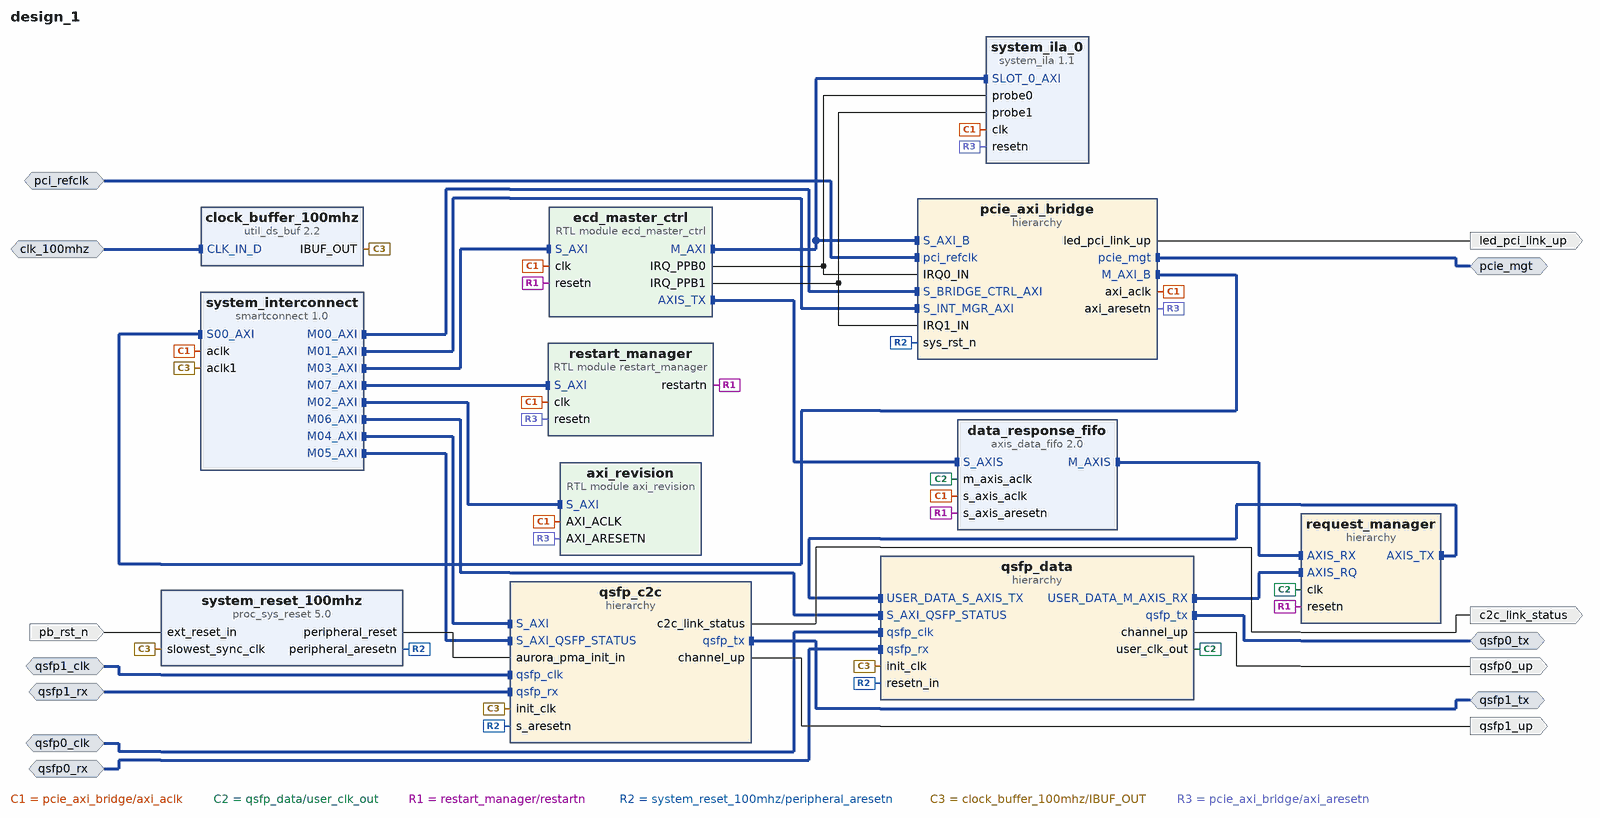
[diagram p0: block diagram of the top level]
# Vivado block design design_1, xczu19eg-ffvc1760-2-i, Vivado 2021.1
create_bd_design design_1

create_bd_intf_port -mode Slave -vlnv xilinx.com:interface:diff_clock_rtl:1.0 clk_100mhz
create_bd_intf_port -mode Slave -vlnv xilinx.com:interface:diff_clock_rtl:1.0 pci_refclk
create_bd_intf_port -mode Master -vlnv xilinx.com:interface:pcie_7x_mgt_rtl:1.0 pcie_mgt
create_bd_intf_port -mode Slave -vlnv xilinx.com:interface:diff_clock_rtl:1.0 qsfp0_clk
set_property -dict {CONFIG.FREQ_HZ 322265625} [get_bd_intf_ports qsfp0_clk]
create_bd_intf_port -mode Master -vlnv xilinx.com:display_aurora:GT_Serial_Transceiver_Pins_TX_rtl:1.0 qsfp0_tx
create_bd_intf_port -mode Slave -vlnv xilinx.com:display_aurora:GT_Serial_Transceiver_Pins_RX_rtl:1.0 qsfp0_rx
create_bd_intf_port -mode Master -vlnv xilinx.com:display_aurora:GT_Serial_Transceiver_Pins_TX_rtl:1.0 qsfp1_tx
create_bd_intf_port -mode Slave -vlnv xilinx.com:display_aurora:GT_Serial_Transceiver_Pins_RX_rtl:1.0 qsfp1_rx
create_bd_intf_port -mode Slave -vlnv xilinx.com:interface:diff_clock_rtl:1.0 qsfp1_clk
set_property -dict {CONFIG.FREQ_HZ 322265625} [get_bd_intf_ports qsfp1_clk]
create_bd_port -dir I -type rst pb_rst_n
create_bd_port -dir O led_pci_link_up
create_bd_port -dir O qsfp0_up
create_bd_port -dir O qsfp1_up
create_bd_port -dir O c2c_link_status

create_bd_cell -type ip -vlnv xilinx.com:ip:proc_sys_reset:5.0 system_reset_100mhz
create_bd_cell -type ip -vlnv xilinx.com:ip:util_ds_buf:2.2 clock_buffer_100mhz
create_bd_cell -type hier pcie_axi_bridge
create_bd_cell -type hier qsfp_data
create_bd_cell -type ip -vlnv xilinx.com:ip:axis_data_fifo:2.0 data_response_fifo
set_property -dict {CONFIG.FIFO_DEPTH 4096 CONFIG.IS_ACLK_ASYNC 1} [get_bd_cells data_response_fifo]
create_bd_cell -type hier qsfp_c2c
create_bd_cell -type module -reference restart_manager restart_manager
create_bd_cell -type hier request_manager
create_bd_cell -type ip -vlnv xilinx.com:ip:system_ila:1.1 system_ila_0
set_property -dict [list \
  CONFIG.C_DATA_DEPTH 4096 \
  CONFIG.C_MON_TYPE MIX \
  CONFIG.C_NUM_MONITOR_SLOTS 1 \
  CONFIG.C_NUM_OF_PROBES 2 \
  CONFIG.C_PROBE0_TYPE 0 \
  CONFIG.C_PROBE1_TYPE 0 \
  CONFIG.C_SLOT_0_APC_EN 0 \
  CONFIG.C_SLOT_0_AXI_AR_SEL_DATA 1 \
  CONFIG.C_SLOT_0_AXI_AR_SEL_TRIG 1 \
  CONFIG.C_SLOT_0_AXI_AW_SEL_DATA 1 \
  CONFIG.C_SLOT_0_AXI_AW_SEL_TRIG 1 \
  CONFIG.C_SLOT_0_AXI_B_SEL_DATA 1 \
  CONFIG.C_SLOT_0_AXI_B_SEL_TRIG 1 \
  CONFIG.C_SLOT_0_AXI_R_SEL_DATA 1 \
  CONFIG.C_SLOT_0_AXI_R_SEL_TRIG 1 \
  CONFIG.C_SLOT_0_AXI_W_SEL_DATA 1 \
  CONFIG.C_SLOT_0_AXI_W_SEL_TRIG 1 \
  CONFIG.C_SLOT_0_INTF_TYPE xilinx.com:interface:aximm_rtl:1.0 \
] [get_bd_cells system_ila_0]
create_bd_cell -type module -reference ecd_master_ctrl ecd_master_ctrl
create_bd_cell -type ip -vlnv xilinx.com:ip:smartconnect:1.0 system_interconnect
set_property -dict {CONFIG.HAS_ARESETN 0 CONFIG.NUM_CLKS 2 CONFIG.NUM_MI 8 CONFIG.NUM_SI 1} [get_bd_cells system_interconnect]
create_bd_cell -type module -reference axi_revision axi_revision

# ---- hierarchy /pcie_axi_bridge ----
current_bd_instance /pcie_axi_bridge
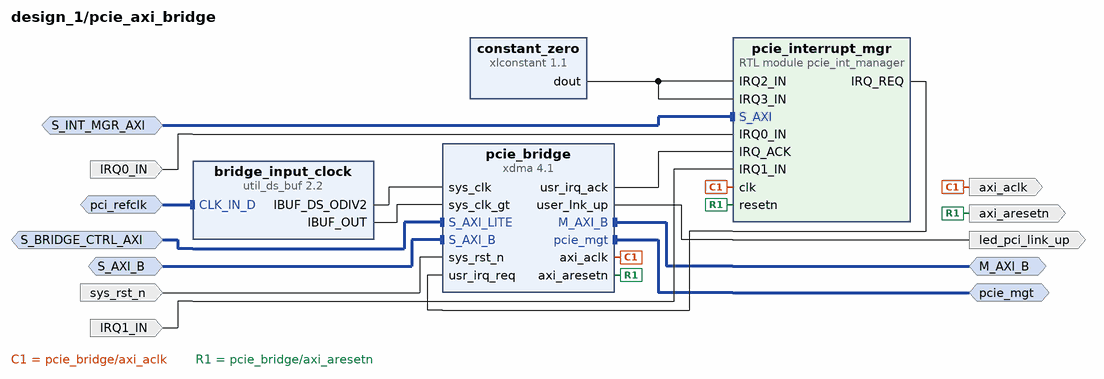
[diagram p1: block diagram inside /pcie_axi_bridge]
create_bd_intf_pin -mode Slave -vlnv xilinx.com:interface:aximm_rtl:1.0 S_BRIDGE_CTRL_AXI
create_bd_intf_pin -mode Slave -vlnv xilinx.com:interface:aximm_rtl:1.0 S_AXI_B
create_bd_intf_pin -mode Master -vlnv xilinx.com:interface:pcie_7x_mgt_rtl:1.0 pcie_mgt
create_bd_intf_pin -mode Master -vlnv xilinx.com:interface:aximm_rtl:1.0 M_AXI_B
create_bd_intf_pin -mode Slave -vlnv xilinx.com:interface:aximm_rtl:1.0 S_INT_MGR_AXI
create_bd_intf_pin -mode Slave -vlnv xilinx.com:interface:diff_clock_rtl:1.0 pci_refclk
create_bd_pin -dir O -type rst axi_aresetn
create_bd_pin -dir O -type clk axi_aclk
create_bd_pin -dir O led_pci_link_up
create_bd_pin -dir I -type rst sys_rst_n
create_bd_pin -dir I IRQ0_IN
create_bd_pin -dir I IRQ1_IN

create_bd_cell -type ip -vlnv xilinx.com:ip:xdma:4.1 pcie_bridge
set_property -dict [list \
  CONFIG.PF0_DEVICE_ID_mqdma 903F \
  CONFIG.PF0_SRIOV_VF_DEVICE_ID A03F \
  CONFIG.PF2_DEVICE_ID_mqdma 923F \
  CONFIG.PF3_DEVICE_ID_mqdma 933F \
  CONFIG.axi_addr_width 64 \
  CONFIG.axi_data_width 512_bit \
  CONFIG.axibar2pciebar_0 0x0 \
  CONFIG.axibar_num 1 \
  CONFIG.axilite_master_en true \
  CONFIG.axilite_master_size 8 \
  CONFIG.axisten_freq 250 \
  CONFIG.bridge_burst true \
  CONFIG.c_s_axi_supports_narrow_burst false \
  CONFIG.cfg_mgmt_if false \
  CONFIG.enable_jtag_dbg true \
  CONFIG.functional_mode AXI_Bridge \
  CONFIG.mode_selection Advanced \
  CONFIG.pcie_blk_locn X1Y0 \
  CONFIG.pcie_extended_tag false \
  CONFIG.pciebar2axibar_0 0x00000000 \
  CONFIG.pciebar2axibar_1 0x800000000 \
  CONFIG.pciebar2axibar_axil_master 0A0000000 \
  CONFIG.pf0_Use_Class_Code_Lookup_Assistant false \
  CONFIG.pf0_bar0_64bit false \
  CONFIG.pf0_bar0_scale Megabytes \
  CONFIG.pf0_bar0_size 1 \
  CONFIG.pf0_bar1_enabled true \
  CONFIG.pf0_bar1_scale Megabytes \
  CONFIG.pf0_bar1_size 1 \
  CONFIG.pf0_bar2_enabled false \
  CONFIG.pf0_base_class_menu Simple_communication_controllers \
  CONFIG.pf0_class_code_base 07 \
  CONFIG.pf0_class_code_interface 01 \
  CONFIG.pf0_class_code_sub 00 \
  CONFIG.pf0_device_id 903F \
  CONFIG.pf0_interrupt_pin INTA \
  CONFIG.pf0_msi_enabled false \
  CONFIG.pf0_sub_class_interface_menu 16450_compatible_serial_controller \
  CONFIG.pf0_subsystem_id 0007 \
  CONFIG.pl_link_cap_max_link_speed 8.0_GT/s \
  CONFIG.pl_link_cap_max_link_width X16 \
  CONFIG.plltype QPLL1 \
  CONFIG.xdma_num_usr_irq 1 \
  CONFIG.xdma_sts_ports false \
  CONFIG.xdma_wnum_rids 32 \
] [get_bd_cells pcie_bridge]
create_bd_cell -type ip -vlnv xilinx.com:ip:xlconstant:1.1 constant_zero
set_property -dict {CONFIG.CONST_VAL 0 CONFIG.CONST_WIDTH 1} [get_bd_cells constant_zero]
create_bd_cell -type ip -vlnv xilinx.com:ip:util_ds_buf:2.2 bridge_input_clock
set_property -dict {CONFIG.C_BUF_TYPE IBUFDSGTE} [get_bd_cells bridge_input_clock]
create_bd_cell -type module -reference pcie_int_manager pcie_interrupt_mgr

# ---- hierarchy /qsfp_data ----
current_bd_instance /qsfp_data
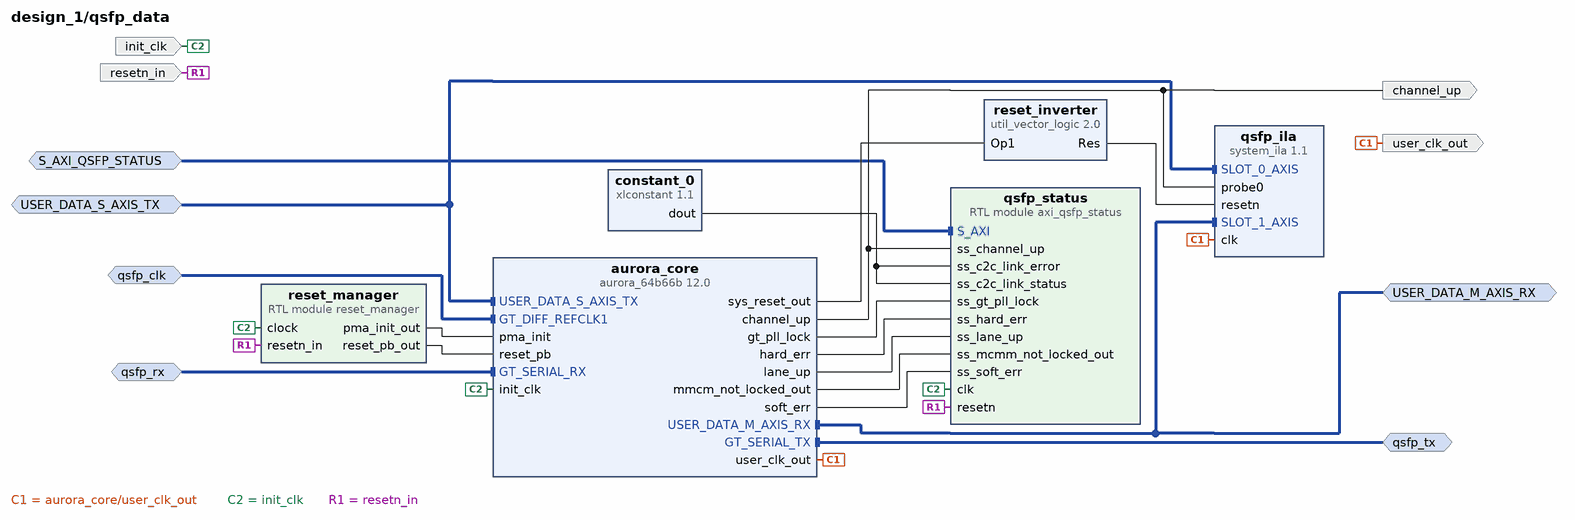
[diagram p2: block diagram inside /qsfp_data]
create_bd_intf_pin -mode Slave -vlnv xilinx.com:interface:diff_clock_rtl:1.0 qsfp_clk
create_bd_intf_pin -mode Master -vlnv xilinx.com:display_aurora:GT_Serial_Transceiver_Pins_TX_rtl:1.0 qsfp_tx
create_bd_intf_pin -mode Slave -vlnv xilinx.com:display_aurora:GT_Serial_Transceiver_Pins_RX_rtl:1.0 qsfp_rx
create_bd_intf_pin -mode Master -vlnv xilinx.com:interface:axis_rtl:1.0 USER_DATA_M_AXIS_RX
create_bd_intf_pin -mode Slave -vlnv xilinx.com:interface:axis_rtl:1.0 USER_DATA_S_AXIS_TX
create_bd_intf_pin -mode Slave -vlnv xilinx.com:interface:aximm_rtl:1.0 S_AXI_QSFP_STATUS
create_bd_pin -dir I -type clk init_clk
create_bd_pin -dir I -type rst resetn_in
create_bd_pin -dir O channel_up
create_bd_pin -dir O -type clk user_clk_out

create_bd_cell -type ip -vlnv xilinx.com:ip:aurora_64b66b:12.0 aurora_core
set_property -dict [list \
  CONFIG.CHANNEL_ENABLE {X0Y12 X0Y13 X0Y14 X0Y15} \
  CONFIG.C_AURORA_LANES 4 \
  CONFIG.C_GT_CLOCK_1 GTYQ0 \
  CONFIG.C_GT_TYPE GTY \
  CONFIG.C_LINE_RATE 25.78125 \
  CONFIG.C_REFCLK_FREQUENCY 322.265625 \
  CONFIG.C_REFCLK_SOURCE MGTREFCLK0_of_Quad_X0Y3 \
  CONFIG.C_START_LANE X0Y12 \
  CONFIG.C_START_QUAD Quad_X0Y3 \
  CONFIG.C_UCOLUMN_USED left \
  CONFIG.SupportLevel 1 \
  CONFIG.drp_mode Disabled \
  CONFIG.interface_mode Streaming \
] [get_bd_cells aurora_core]
create_bd_cell -type ip -vlnv xilinx.com:ip:util_vector_logic:2.0 reset_inverter
set_property -dict {CONFIG.C_OPERATION not CONFIG.C_SIZE 1} [get_bd_cells reset_inverter]
create_bd_cell -type ip -vlnv xilinx.com:ip:system_ila:1.1 qsfp_ila
set_property -dict [list \
  CONFIG.C_DATA_DEPTH 2048 \
  CONFIG.C_MON_TYPE MIX \
  CONFIG.C_NUM_MONITOR_SLOTS 2 \
  CONFIG.C_NUM_OF_PROBES 1 \
  CONFIG.C_PROBE0_TYPE 0 \
  CONFIG.C_SLOT_0_APC_EN 0 \
  CONFIG.C_SLOT_0_AXI_DATA_SEL 1 \
  CONFIG.C_SLOT_0_AXI_TRIG_SEL 1 \
  CONFIG.C_SLOT_0_INTF_TYPE xilinx.com:interface:axis_rtl:1.0 \
  CONFIG.C_SLOT_1_APC_EN 0 \
  CONFIG.C_SLOT_1_AXI_DATA_SEL 1 \
  CONFIG.C_SLOT_1_AXI_TRIG_SEL 1 \
  CONFIG.C_SLOT_1_INTF_TYPE xilinx.com:interface:axis_rtl:1.0 \
] [get_bd_cells qsfp_ila]
create_bd_cell -type ip -vlnv xilinx.com:ip:xlconstant:1.1 constant_0
set_property -dict {CONFIG.CONST_VAL 0 CONFIG.CONST_WIDTH 1} [get_bd_cells constant_0]
create_bd_cell -type module -reference axi_qsfp_status qsfp_status
set_property -dict {CONFIG.LANE_COUNT 4} [get_bd_cells qsfp_status]
create_bd_cell -type module -reference reset_manager reset_manager

# ---- hierarchy /qsfp_c2c ----
current_bd_instance /qsfp_c2c
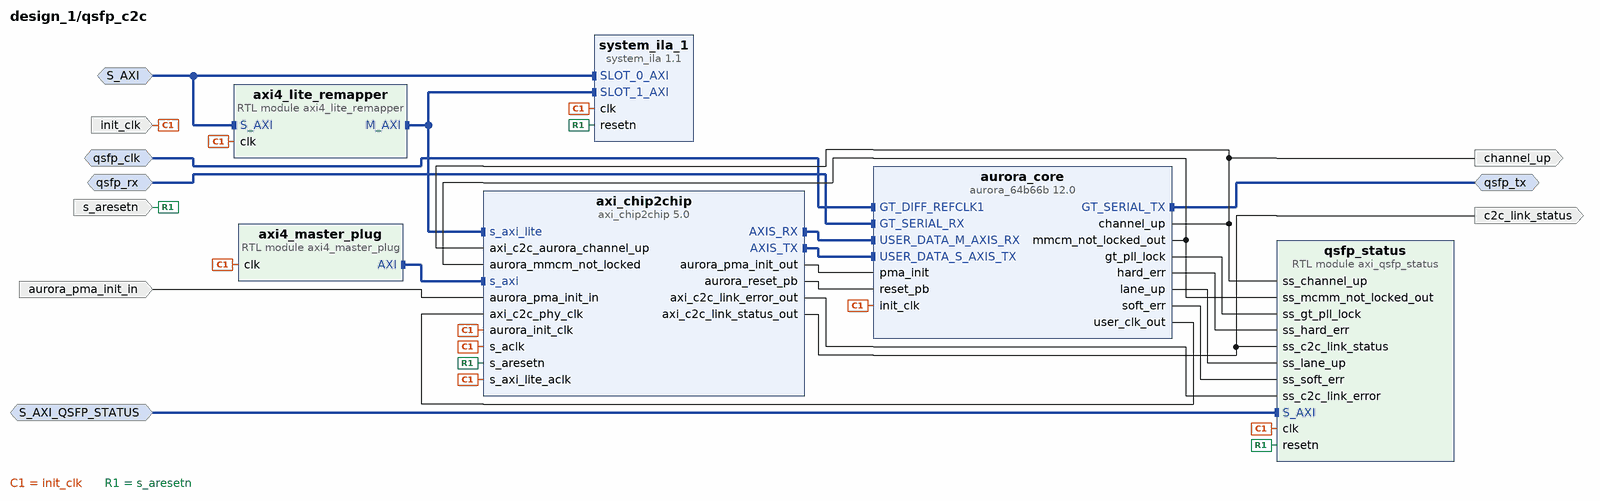
[diagram p3: block diagram inside /qsfp_c2c]
create_bd_intf_pin -mode Slave -vlnv xilinx.com:interface:diff_clock_rtl:1.0 qsfp_clk
create_bd_intf_pin -mode Master -vlnv xilinx.com:display_aurora:GT_Serial_Transceiver_Pins_TX_rtl:1.0 qsfp_tx
create_bd_intf_pin -mode Slave -vlnv xilinx.com:display_aurora:GT_Serial_Transceiver_Pins_RX_rtl:1.0 qsfp_rx
create_bd_intf_pin -mode Slave -vlnv xilinx.com:interface:aximm_rtl:1.0 S_AXI
create_bd_intf_pin -mode Slave -vlnv xilinx.com:interface:aximm_rtl:1.0 S_AXI_QSFP_STATUS
create_bd_pin -dir O channel_up
create_bd_pin -dir O c2c_link_status
create_bd_pin -dir I -type clk init_clk
create_bd_pin -dir I -type rst s_aresetn
create_bd_pin -dir I -type rst aurora_pma_init_in

create_bd_cell -type ip -vlnv xilinx.com:ip:aurora_64b66b:12.0 aurora_core
set_property -dict [list \
  CONFIG.CHANNEL_ENABLE X0Y16 \
  CONFIG.C_GT_CLOCK_1 GTYQ0 \
  CONFIG.C_GT_TYPE GTY \
  CONFIG.C_REFCLK_FREQUENCY 322.265625 \
  CONFIG.C_REFCLK_SOURCE MGTREFCLK0_of_Quad_X0Y4 \
  CONFIG.C_START_LANE X0Y16 \
  CONFIG.C_START_QUAD Quad_X0Y4 \
  CONFIG.C_UCOLUMN_USED left \
  CONFIG.SupportLevel 1 \
  CONFIG.drp_mode Disabled \
  CONFIG.interface_mode Streaming \
] [get_bd_cells aurora_core]
create_bd_cell -type ip -vlnv xilinx.com:ip:axi_chip2chip:5.0 axi_chip2chip
set_property -dict [list \
  CONFIG.C_EN_AXI_LINK_HNDLR true \
  CONFIG.C_INCLUDE_AXILITE 1 \
  CONFIG.C_INTERFACE_MODE 0 \
  CONFIG.C_INTERFACE_TYPE 2 \
] [get_bd_cells axi_chip2chip]
create_bd_cell -type module -reference axi4_master_plug axi4_master_plug
create_bd_cell -type module -reference axi4_lite_remapper axi4_lite_remapper
set_property -dict {CONFIG.LOCAL_BASE_ADDR 0x00010000} [get_bd_cells axi4_lite_remapper]
create_bd_cell -type module -reference axi_qsfp_status qsfp_status
create_bd_cell -type ip -vlnv xilinx.com:ip:system_ila:1.1 system_ila_1
set_property -dict [list \
  CONFIG.C_MON_TYPE INTERFACE \
  CONFIG.C_NUM_MONITOR_SLOTS 2 \
  CONFIG.C_SLOT_0_APC_EN 0 \
  CONFIG.C_SLOT_0_AXI_AR_SEL_DATA 1 \
  CONFIG.C_SLOT_0_AXI_AR_SEL_TRIG 1 \
  CONFIG.C_SLOT_0_AXI_AW_SEL_DATA 1 \
  CONFIG.C_SLOT_0_AXI_AW_SEL_TRIG 1 \
  CONFIG.C_SLOT_0_AXI_B_SEL_DATA 1 \
  CONFIG.C_SLOT_0_AXI_B_SEL_TRIG 1 \
  CONFIG.C_SLOT_0_AXI_R_SEL_DATA 1 \
  CONFIG.C_SLOT_0_AXI_R_SEL_TRIG 1 \
  CONFIG.C_SLOT_0_AXI_W_SEL_DATA 1 \
  CONFIG.C_SLOT_0_AXI_W_SEL_TRIG 1 \
  CONFIG.C_SLOT_0_INTF_TYPE xilinx.com:interface:aximm_rtl:1.0 \
  CONFIG.C_SLOT_1_APC_EN 0 \
  CONFIG.C_SLOT_1_AXI_AR_SEL_DATA 1 \
  CONFIG.C_SLOT_1_AXI_AR_SEL_TRIG 1 \
  CONFIG.C_SLOT_1_AXI_AW_SEL_DATA 1 \
  CONFIG.C_SLOT_1_AXI_AW_SEL_TRIG 1 \
  CONFIG.C_SLOT_1_AXI_B_SEL_DATA 1 \
  CONFIG.C_SLOT_1_AXI_B_SEL_TRIG 1 \
  CONFIG.C_SLOT_1_AXI_R_SEL_DATA 1 \
  CONFIG.C_SLOT_1_AXI_R_SEL_TRIG 1 \
  CONFIG.C_SLOT_1_AXI_W_SEL_DATA 1 \
  CONFIG.C_SLOT_1_AXI_W_SEL_TRIG 1 \
  CONFIG.C_SLOT_1_INTF_TYPE xilinx.com:interface:aximm_rtl:1.0 \
] [get_bd_cells system_ila_1]

# ---- hierarchy /request_manager ----
current_bd_instance /request_manager
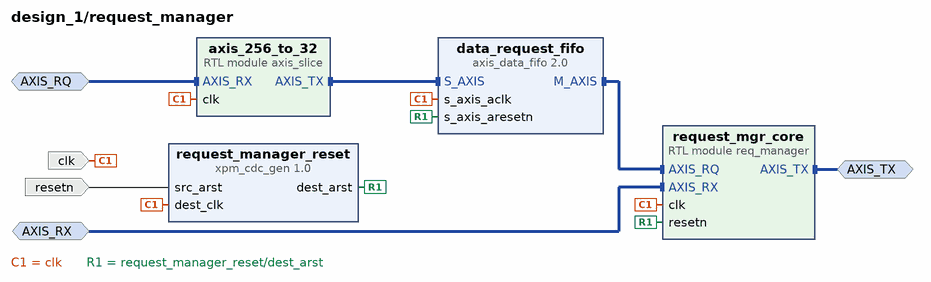
[diagram p4: block diagram inside /request_manager]
create_bd_intf_pin -mode Slave -vlnv xilinx.com:interface:axis_rtl:1.0 AXIS_RX
create_bd_intf_pin -mode Master -vlnv xilinx.com:interface:axis_rtl:1.0 AXIS_TX
create_bd_intf_pin -mode Slave -vlnv xilinx.com:interface:axis_rtl:1.0 AXIS_RQ
create_bd_pin -dir I -type clk clk
create_bd_pin -dir I resetn

create_bd_cell -type module -reference req_manager request_mgr_core
create_bd_cell -type ip -vlnv xilinx.com:ip:axis_data_fifo:2.0 data_request_fifo
set_property -dict {CONFIG.FIFO_DEPTH 64} [get_bd_cells data_request_fifo]
create_bd_cell -type module -reference axis_slice axis_256_to_32
create_bd_cell -type ip -vlnv xilinx.com:ip:xpm_cdc_gen:1.0 request_manager_reset
set_property -dict {CONFIG.CDC_TYPE xpm_cdc_async_rst CONFIG.WIDTH 1} [get_bd_cells request_manager_reset]

# ---- connections ----

current_bd_instance /pcie_axi_bridge
connect_bd_intf_net [get_bd_intf_pins S_BRIDGE_CTRL_AXI] [get_bd_intf_pins pcie_bridge/S_AXI_LITE]
connect_bd_intf_net [get_bd_intf_pins S_AXI_B] [get_bd_intf_pins pcie_bridge/S_AXI_B]
connect_bd_intf_net [get_bd_intf_pins pcie_mgt] [get_bd_intf_pins pcie_bridge/pcie_mgt]
connect_bd_intf_net [get_bd_intf_pins M_AXI_B] [get_bd_intf_pins pcie_bridge/M_AXI_B]
connect_bd_intf_net [get_bd_intf_pins S_INT_MGR_AXI] [get_bd_intf_pins pcie_interrupt_mgr/S_AXI]
connect_bd_intf_net [get_bd_intf_pins pci_refclk] [get_bd_intf_pins bridge_input_clock/CLK_IN_D]
connect_bd_net -net IRQ0_IN_1 [get_bd_pins IRQ0_IN] [get_bd_pins pcie_interrupt_mgr/IRQ0_IN]
connect_bd_net -net IRQ1_IN_1 [get_bd_pins constant_zero/dout] [get_bd_pins pcie_interrupt_mgr/IRQ2_IN] [get_bd_pins pcie_interrupt_mgr/IRQ3_IN]
connect_bd_net -net IRQ1_IN_2 [get_bd_pins IRQ1_IN] [get_bd_pins pcie_interrupt_mgr/IRQ1_IN]
connect_bd_net [get_bd_pins bridge_input_clock/IBUF_DS_ODIV2] [get_bd_pins pcie_bridge/sys_clk]
connect_bd_net [get_bd_pins bridge_input_clock/IBUF_OUT] [get_bd_pins pcie_bridge/sys_clk_gt]
connect_bd_net [get_bd_pins pcie_bridge/axi_aclk] [get_bd_pins axi_aclk] [get_bd_pins pcie_interrupt_mgr/clk]
connect_bd_net [get_bd_pins pcie_bridge/axi_aresetn] [get_bd_pins axi_aresetn] [get_bd_pins pcie_interrupt_mgr/resetn]
connect_bd_net [get_bd_pins pcie_bridge/user_lnk_up] [get_bd_pins led_pci_link_up]
connect_bd_net [get_bd_pins pcie_bridge/usr_irq_ack] [get_bd_pins pcie_interrupt_mgr/IRQ_ACK]
connect_bd_net [get_bd_pins pcie_interrupt_mgr/IRQ_REQ] [get_bd_pins pcie_bridge/usr_irq_req]
connect_bd_net [get_bd_pins sys_rst_n] [get_bd_pins pcie_bridge/sys_rst_n]
set_property HDL_ATTRIBUTE.DEBUG true [get_bd_nets IRQ0_IN_1]
set_property HDL_ATTRIBUTE.MARK_DEBUG true [get_bd_nets IRQ0_IN_1]
set_property HDL_ATTRIBUTE.DEBUG true [get_bd_nets IRQ1_IN_2]

current_bd_instance /qsfp_data
connect_bd_intf_net [get_bd_intf_pins USER_DATA_M_AXIS_RX] [get_bd_intf_pins aurora_core/USER_DATA_M_AXIS_RX]
connect_bd_intf_net [get_bd_intf_pins USER_DATA_M_AXIS_RX] [get_bd_intf_pins qsfp_ila/SLOT_1_AXIS]
connect_bd_intf_net [get_bd_intf_pins USER_DATA_S_AXIS_TX] [get_bd_intf_pins aurora_core/USER_DATA_S_AXIS_TX]
connect_bd_intf_net [get_bd_intf_pins USER_DATA_S_AXIS_TX] [get_bd_intf_pins qsfp_ila/SLOT_0_AXIS]
connect_bd_intf_net [get_bd_intf_pins S_AXI_QSFP_STATUS] [get_bd_intf_pins qsfp_status/S_AXI]
connect_bd_intf_net [get_bd_intf_pins qsfp_clk] [get_bd_intf_pins aurora_core/GT_DIFF_REFCLK1]
connect_bd_intf_net [get_bd_intf_pins qsfp_rx] [get_bd_intf_pins aurora_core/GT_SERIAL_RX]
connect_bd_intf_net [get_bd_intf_pins qsfp_tx] [get_bd_intf_pins aurora_core/GT_SERIAL_TX]
connect_bd_net -net aurora_64b66b_0_channel_up [get_bd_pins aurora_core/channel_up] \
  [get_bd_pins channel_up] [get_bd_pins qsfp_ila/probe0] [get_bd_pins qsfp_status/ss_channel_up]
connect_bd_net -net aurora_64b66b_0_sys_reset_out [get_bd_pins aurora_core/sys_reset_out] [get_bd_pins reset_inverter/Op1]
connect_bd_net -net aurora_64b66b_0_user_clk_out [get_bd_pins aurora_core/user_clk_out] [get_bd_pins user_clk_out] [get_bd_pins qsfp_ila/clk]
connect_bd_net [get_bd_pins aurora_core/gt_pll_lock] [get_bd_pins qsfp_status/ss_gt_pll_lock]
connect_bd_net [get_bd_pins aurora_core/hard_err] [get_bd_pins qsfp_status/ss_hard_err]
connect_bd_net [get_bd_pins aurora_core/lane_up] [get_bd_pins qsfp_status/ss_lane_up]
connect_bd_net [get_bd_pins aurora_core/mmcm_not_locked_out] [get_bd_pins qsfp_status/ss_mcmm_not_locked_out]
connect_bd_net [get_bd_pins aurora_core/soft_err] [get_bd_pins qsfp_status/ss_soft_err]
connect_bd_net -net clock_1 [get_bd_pins init_clk] [get_bd_pins aurora_core/init_clk] [get_bd_pins qsfp_status/clk] [get_bd_pins reset_manager/clock]
connect_bd_net [get_bd_pins constant_0/dout] [get_bd_pins qsfp_status/ss_c2c_link_status] [get_bd_pins qsfp_status/ss_c2c_link_error]
connect_bd_net -net reset_in_1 [get_bd_pins resetn_in] [get_bd_pins qsfp_status/resetn] [get_bd_pins reset_manager/resetn_in]
connect_bd_net [get_bd_pins reset_inverter/Res] [get_bd_pins qsfp_ila/resetn]
connect_bd_net [get_bd_pins reset_manager/pma_init_out] [get_bd_pins aurora_core/pma_init]
connect_bd_net [get_bd_pins reset_manager/reset_pb_out] [get_bd_pins aurora_core/reset_pb]
set_property HDL_ATTRIBUTE.DEBUG true [get_bd_nets aurora_64b66b_0_channel_up]
set_property HDL_ATTRIBUTE.MARK_DEBUG true [get_bd_nets aurora_64b66b_0_channel_up]

current_bd_instance /qsfp_c2c
connect_bd_intf_net [get_bd_intf_pins S_AXI] [get_bd_intf_pins axi4_lite_remapper/S_AXI]
connect_bd_intf_net [get_bd_intf_pins S_AXI] [get_bd_intf_pins system_ila_1/SLOT_0_AXI]
connect_bd_intf_net [get_bd_intf_pins S_AXI_QSFP_STATUS] [get_bd_intf_pins qsfp_status/S_AXI]
connect_bd_intf_net [get_bd_intf_pins qsfp_clk] [get_bd_intf_pins aurora_core/GT_DIFF_REFCLK1]
connect_bd_intf_net [get_bd_intf_pins qsfp_rx] [get_bd_intf_pins aurora_core/GT_SERIAL_RX]
connect_bd_intf_net [get_bd_intf_pins qsfp_tx] [get_bd_intf_pins aurora_core/GT_SERIAL_TX]
connect_bd_intf_net [get_bd_intf_pins axi_chip2chip/AXIS_RX] [get_bd_intf_pins aurora_core/USER_DATA_M_AXIS_RX]
connect_bd_intf_net [get_bd_intf_pins axi4_lite_remapper/M_AXI] [get_bd_intf_pins axi_chip2chip/s_axi_lite]
connect_bd_intf_net [get_bd_intf_pins axi4_lite_remapper/M_AXI] [get_bd_intf_pins system_ila_1/SLOT_1_AXI]
connect_bd_intf_net [get_bd_intf_pins axi4_master_plug/AXI] [get_bd_intf_pins axi_chip2chip/s_axi]
connect_bd_intf_net [get_bd_intf_pins axi_chip2chip/AXIS_TX] [get_bd_intf_pins aurora_core/USER_DATA_S_AXIS_TX]
connect_bd_net [get_bd_pins aurora_core/channel_up] \
  [get_bd_pins channel_up] [get_bd_pins axi_chip2chip/axi_c2c_aurora_channel_up] [get_bd_pins qsfp_status/ss_channel_up]
connect_bd_net [get_bd_pins aurora_core/gt_pll_lock] [get_bd_pins qsfp_status/ss_gt_pll_lock]
connect_bd_net [get_bd_pins aurora_core/hard_err] [get_bd_pins qsfp_status/ss_hard_err]
connect_bd_net [get_bd_pins aurora_core/lane_up] [get_bd_pins qsfp_status/ss_lane_up]
connect_bd_net [get_bd_pins aurora_core/mmcm_not_locked_out] \
  [get_bd_pins axi_chip2chip/aurora_mmcm_not_locked] [get_bd_pins qsfp_status/ss_mcmm_not_locked_out]
connect_bd_net [get_bd_pins aurora_core/soft_err] [get_bd_pins qsfp_status/ss_soft_err]
connect_bd_net [get_bd_pins aurora_core/user_clk_out] [get_bd_pins axi_chip2chip/axi_c2c_phy_clk]
connect_bd_net -net aurora_init_clk_1 [get_bd_pins init_clk] \
  [get_bd_pins axi_chip2chip/aurora_init_clk] [get_bd_pins axi_chip2chip/s_axi_lite_aclk] [get_bd_pins axi_chip2chip/s_aclk] \
  [get_bd_pins axi4_master_plug/clk] [get_bd_pins aurora_core/init_clk] [get_bd_pins axi4_lite_remapper/clk] \
  [get_bd_pins qsfp_status/clk] [get_bd_pins system_ila_1/clk]
connect_bd_net [get_bd_pins aurora_pma_init_in] [get_bd_pins axi_chip2chip/aurora_pma_init_in]
connect_bd_net [get_bd_pins axi_chip2chip/aurora_pma_init_out] [get_bd_pins aurora_core/pma_init]
connect_bd_net [get_bd_pins axi_chip2chip/aurora_reset_pb] [get_bd_pins aurora_core/reset_pb]
connect_bd_net [get_bd_pins axi_chip2chip/axi_c2c_link_error_out] [get_bd_pins qsfp_status/ss_c2c_link_error]
connect_bd_net [get_bd_pins axi_chip2chip/axi_c2c_link_status_out] [get_bd_pins c2c_link_status] [get_bd_pins qsfp_status/ss_c2c_link_status]
connect_bd_net [get_bd_pins s_aresetn] [get_bd_pins axi_chip2chip/s_aresetn] [get_bd_pins qsfp_status/resetn] [get_bd_pins system_ila_1/resetn]

current_bd_instance /request_manager
connect_bd_intf_net [get_bd_intf_pins AXIS_RQ] [get_bd_intf_pins axis_256_to_32/AXIS_RX]
connect_bd_intf_net [get_bd_intf_pins data_request_fifo/S_AXIS] [get_bd_intf_pins axis_256_to_32/AXIS_TX]
connect_bd_intf_net [get_bd_intf_pins request_mgr_core/AXIS_RQ] [get_bd_intf_pins data_request_fifo/M_AXIS]
connect_bd_intf_net [get_bd_intf_pins AXIS_RX] [get_bd_intf_pins request_mgr_core/AXIS_RX]
connect_bd_intf_net [get_bd_intf_pins AXIS_TX] [get_bd_intf_pins request_mgr_core/AXIS_TX]
connect_bd_net -net qsfp_data_user_clk_out [get_bd_pins clk] \
  [get_bd_pins request_mgr_core/clk] [get_bd_pins data_request_fifo/s_axis_aclk] [get_bd_pins axis_256_to_32/clk] \
  [get_bd_pins request_manager_reset/dest_clk]
connect_bd_net [get_bd_pins request_manager_reset/dest_arst] [get_bd_pins request_mgr_core/resetn] [get_bd_pins data_request_fifo/s_axis_aresetn]
connect_bd_net -net src_arst_1 [get_bd_pins resetn] [get_bd_pins request_manager_reset/src_arst]

current_bd_instance /
connect_bd_intf_net [get_bd_intf_ports clk_100mhz] [get_bd_intf_pins clock_buffer_100mhz/CLK_IN_D]
connect_bd_intf_net [get_bd_intf_ports qsfp0_clk] [get_bd_intf_pins qsfp_data/qsfp_clk]
connect_bd_intf_net [get_bd_intf_ports qsfp1_clk] [get_bd_intf_pins qsfp_c2c/qsfp_clk]
connect_bd_intf_net [get_bd_intf_ports qsfp0_rx] [get_bd_intf_pins qsfp_data/qsfp_rx]
connect_bd_intf_net [get_bd_intf_ports qsfp1_rx] [get_bd_intf_pins qsfp_c2c/qsfp_rx]
connect_bd_intf_net [get_bd_intf_pins qsfp_c2c/S_AXI] [get_bd_intf_pins system_interconnect/M04_AXI]
connect_bd_intf_net [get_bd_intf_pins qsfp_c2c/S_AXI_QSFP_STATUS] [get_bd_intf_pins system_interconnect/M05_AXI]
connect_bd_intf_net [get_bd_intf_pins qsfp_data/S_AXI_QSFP_STATUS] [get_bd_intf_pins system_interconnect/M06_AXI]
connect_bd_intf_net [get_bd_intf_pins qsfp_data/USER_DATA_S_AXIS_TX] [get_bd_intf_pins request_manager/AXIS_TX]
connect_bd_intf_net [get_bd_intf_ports qsfp0_tx] [get_bd_intf_pins qsfp_data/qsfp_tx]
connect_bd_intf_net [get_bd_intf_ports qsfp1_tx] [get_bd_intf_pins qsfp_c2c/qsfp_tx]
connect_bd_intf_net [get_bd_intf_pins data_response_fifo/M_AXIS] [get_bd_intf_pins request_manager/AXIS_RX]
connect_bd_intf_net [get_bd_intf_pins ecd_master_ctrl/AXIS_TX] [get_bd_intf_pins data_response_fifo/S_AXIS]
connect_bd_intf_net [get_bd_intf_pins ecd_master_ctrl/M_AXI] [get_bd_intf_pins pcie_axi_bridge/S_AXI_B]
connect_bd_intf_net [get_bd_intf_pins ecd_master_ctrl/M_AXI] [get_bd_intf_pins system_ila_0/SLOT_0_AXI]
connect_bd_intf_net [get_bd_intf_ports pci_refclk] [get_bd_intf_pins pcie_axi_bridge/pci_refclk]
connect_bd_intf_net [get_bd_intf_pins pcie_axi_bridge/M_AXI_B] [get_bd_intf_pins system_interconnect/S00_AXI]
connect_bd_intf_net [get_bd_intf_ports pcie_mgt] [get_bd_intf_pins pcie_axi_bridge/pcie_mgt]
connect_bd_intf_net [get_bd_intf_pins qsfp_data/USER_DATA_M_AXIS_RX] [get_bd_intf_pins request_manager/AXIS_RQ]
connect_bd_intf_net [get_bd_intf_pins system_interconnect/M00_AXI] [get_bd_intf_pins pcie_axi_bridge/S_BRIDGE_CTRL_AXI]
connect_bd_intf_net [get_bd_intf_pins system_interconnect/M01_AXI] [get_bd_intf_pins pcie_axi_bridge/S_INT_MGR_AXI]
connect_bd_intf_net [get_bd_intf_pins axi_revision/S_AXI] [get_bd_intf_pins system_interconnect/M02_AXI]
connect_bd_intf_net [get_bd_intf_pins ecd_master_ctrl/S_AXI] [get_bd_intf_pins system_interconnect/M03_AXI]
connect_bd_intf_net [get_bd_intf_pins restart_manager/S_AXI] [get_bd_intf_pins system_interconnect/M07_AXI]
connect_bd_net -net ecd_master_ctrl_IRQ_PPB0 [get_bd_pins ecd_master_ctrl/IRQ_PPB0] \
  [get_bd_pins pcie_axi_bridge/IRQ0_IN] [get_bd_pins system_ila_0/probe0]
connect_bd_net -net ecd_master_ctrl_IRQ_PPB1 [get_bd_pins ecd_master_ctrl/IRQ_PPB1] \
  [get_bd_pins pcie_axi_bridge/IRQ1_IN] [get_bd_pins system_ila_0/probe1]
connect_bd_net -net ext_reset_in_0_1 [get_bd_ports pb_rst_n] [get_bd_pins system_reset_100mhz/ext_reset_in]
connect_bd_net -net ila_250mhz [get_bd_pins pcie_axi_bridge/axi_aclk] \
  [get_bd_pins data_response_fifo/s_axis_aclk] [get_bd_pins restart_manager/clk] [get_bd_pins system_ila_0/clk] \
  [get_bd_pins ecd_master_ctrl/clk] [get_bd_pins system_interconnect/aclk] [get_bd_pins axi_revision/AXI_ACLK]
connect_bd_net [get_bd_pins pcie_axi_bridge/led_pci_link_up] [get_bd_ports led_pci_link_up]
connect_bd_net -net qsfp_c2c_axi_c2c_link_status_out_0 [get_bd_pins qsfp_c2c/c2c_link_status] [get_bd_ports c2c_link_status]
connect_bd_net [get_bd_pins qsfp_c2c/channel_up] [get_bd_ports qsfp1_up]
connect_bd_net -net qsfp_data_channel_up_0 [get_bd_pins qsfp_data/channel_up] [get_bd_ports qsfp0_up]
connect_bd_net [get_bd_pins qsfp_data/user_clk_out] [get_bd_pins data_response_fifo/m_axis_aclk] [get_bd_pins request_manager/clk]
connect_bd_net -net restartn [get_bd_pins restart_manager/restartn] \
  [get_bd_pins data_response_fifo/s_axis_aresetn] [get_bd_pins request_manager/resetn] [get_bd_pins ecd_master_ctrl/resetn]
connect_bd_net [get_bd_pins system_reset_100mhz/peripheral_aresetn] \
  [get_bd_pins pcie_axi_bridge/sys_rst_n] [get_bd_pins qsfp_c2c/s_aresetn] [get_bd_pins qsfp_data/resetn_in]
connect_bd_net [get_bd_pins system_reset_100mhz/peripheral_reset] [get_bd_pins qsfp_c2c/aurora_pma_init_in]
connect_bd_net -net util_ds_buf_0_IBUF_OUT [get_bd_pins clock_buffer_100mhz/IBUF_OUT] \
  [get_bd_pins system_reset_100mhz/slowest_sync_clk] [get_bd_pins qsfp_data/init_clk] [get_bd_pins qsfp_c2c/init_clk] \
  [get_bd_pins system_interconnect/aclk1]
connect_bd_net -net xdma_0_axi_aresetn [get_bd_pins pcie_axi_bridge/axi_aresetn] \
  [get_bd_pins restart_manager/resetn] [get_bd_pins system_ila_0/resetn] [get_bd_pins axi_revision/AXI_ARESETN]
set_property HDL_ATTRIBUTE.DEBUG true [get_bd_nets ecd_master_ctrl_IRQ_PPB0]
set_property HDL_ATTRIBUTE.DEBUG true [get_bd_nets ecd_master_ctrl_IRQ_PPB1]
set_property HDL_ATTRIBUTE.MARK_DEBUG true [get_bd_nets ecd_master_ctrl_IRQ_PPB1]
set_property HDL_ATTRIBUTE.DEBUG true [get_bd_nets qsfp_data_channel_up_0]
set_property HDL_ATTRIBUTE.MARK_DEBUG true [get_bd_nets qsfp_data_channel_up_0]

# ---- address map ----
assign_bd_address -offset 0x0000000000000000 -range 16E -target_address_space [get_bd_addr_spaces ecd_master_ctrl/M_AXI] [get_bd_addr_segs pcie_axi_bridge/pcie_bridge/S_AXI_B/BAR0]
assign_bd_address -offset 0x0000000000000000 -range 256 -target_address_space [get_bd_addr_spaces pcie_axi_bridge/pcie_bridge/M_AXI_B] [get_bd_addr_segs axi_revision/S_AXI/reg0]
assign_bd_address -offset 0x0000000000000100 -range 256 -target_address_space [get_bd_addr_spaces pcie_axi_bridge/pcie_bridge/M_AXI_B] [get_bd_addr_segs ecd_master_ctrl/S_AXI/reg0]
assign_bd_address -offset 0x0000000000000200 -range 256 -target_address_space [get_bd_addr_spaces pcie_axi_bridge/pcie_bridge/M_AXI_B] [get_bd_addr_segs pcie_axi_bridge/pcie_interrupt_mgr/S_AXI/reg0]
assign_bd_address -offset 0x0000000000000300 -range 256 -target_address_space [get_bd_addr_spaces pcie_axi_bridge/pcie_bridge/M_AXI_B] [get_bd_addr_segs restart_manager/S_AXI/reg0]
assign_bd_address -offset 0x0000000000000400 -range 256 -target_address_space [get_bd_addr_spaces pcie_axi_bridge/pcie_bridge/M_AXI_B] [get_bd_addr_segs qsfp_data/qsfp_status/S_AXI/reg0]
assign_bd_address -offset 0x0000000000000500 -range 256 -target_address_space [get_bd_addr_spaces pcie_axi_bridge/pcie_bridge/M_AXI_B] [get_bd_addr_segs qsfp_c2c/qsfp_status/S_AXI/reg0]
assign_bd_address -offset 0x0000000000009000 -range 4K -target_address_space [get_bd_addr_spaces pcie_axi_bridge/pcie_bridge/M_AXI_B] [get_bd_addr_segs pcie_axi_bridge/pcie_bridge/S_AXI_LITE/CTL0]
assign_bd_address -offset 0x0000000000010000 -range 64K -target_address_space [get_bd_addr_spaces pcie_axi_bridge/pcie_bridge/M_AXI_B] [get_bd_addr_segs qsfp_c2c/axi4_lite_remapper/S_AXI/reg0]
assign_bd_address -offset 0x00000000 -range 4G -target_address_space [get_bd_addr_spaces qsfp_c2c/axi4_lite_remapper/M_AXI] [get_bd_addr_segs qsfp_c2c/axi_chip2chip/s_axi_lite/Reg]
assign_bd_address -offset 0x00000000 -range 4G -target_address_space [get_bd_addr_spaces qsfp_c2c/axi4_master_plug/AXI] [get_bd_addr_segs qsfp_c2c/axi_chip2chip/s_axi/Mem0]

validate_bd_design
save_bd_design
